# EAGLE schematic 1Sheeld.Schematics.v1.0.0 (EAGLE 6.3)
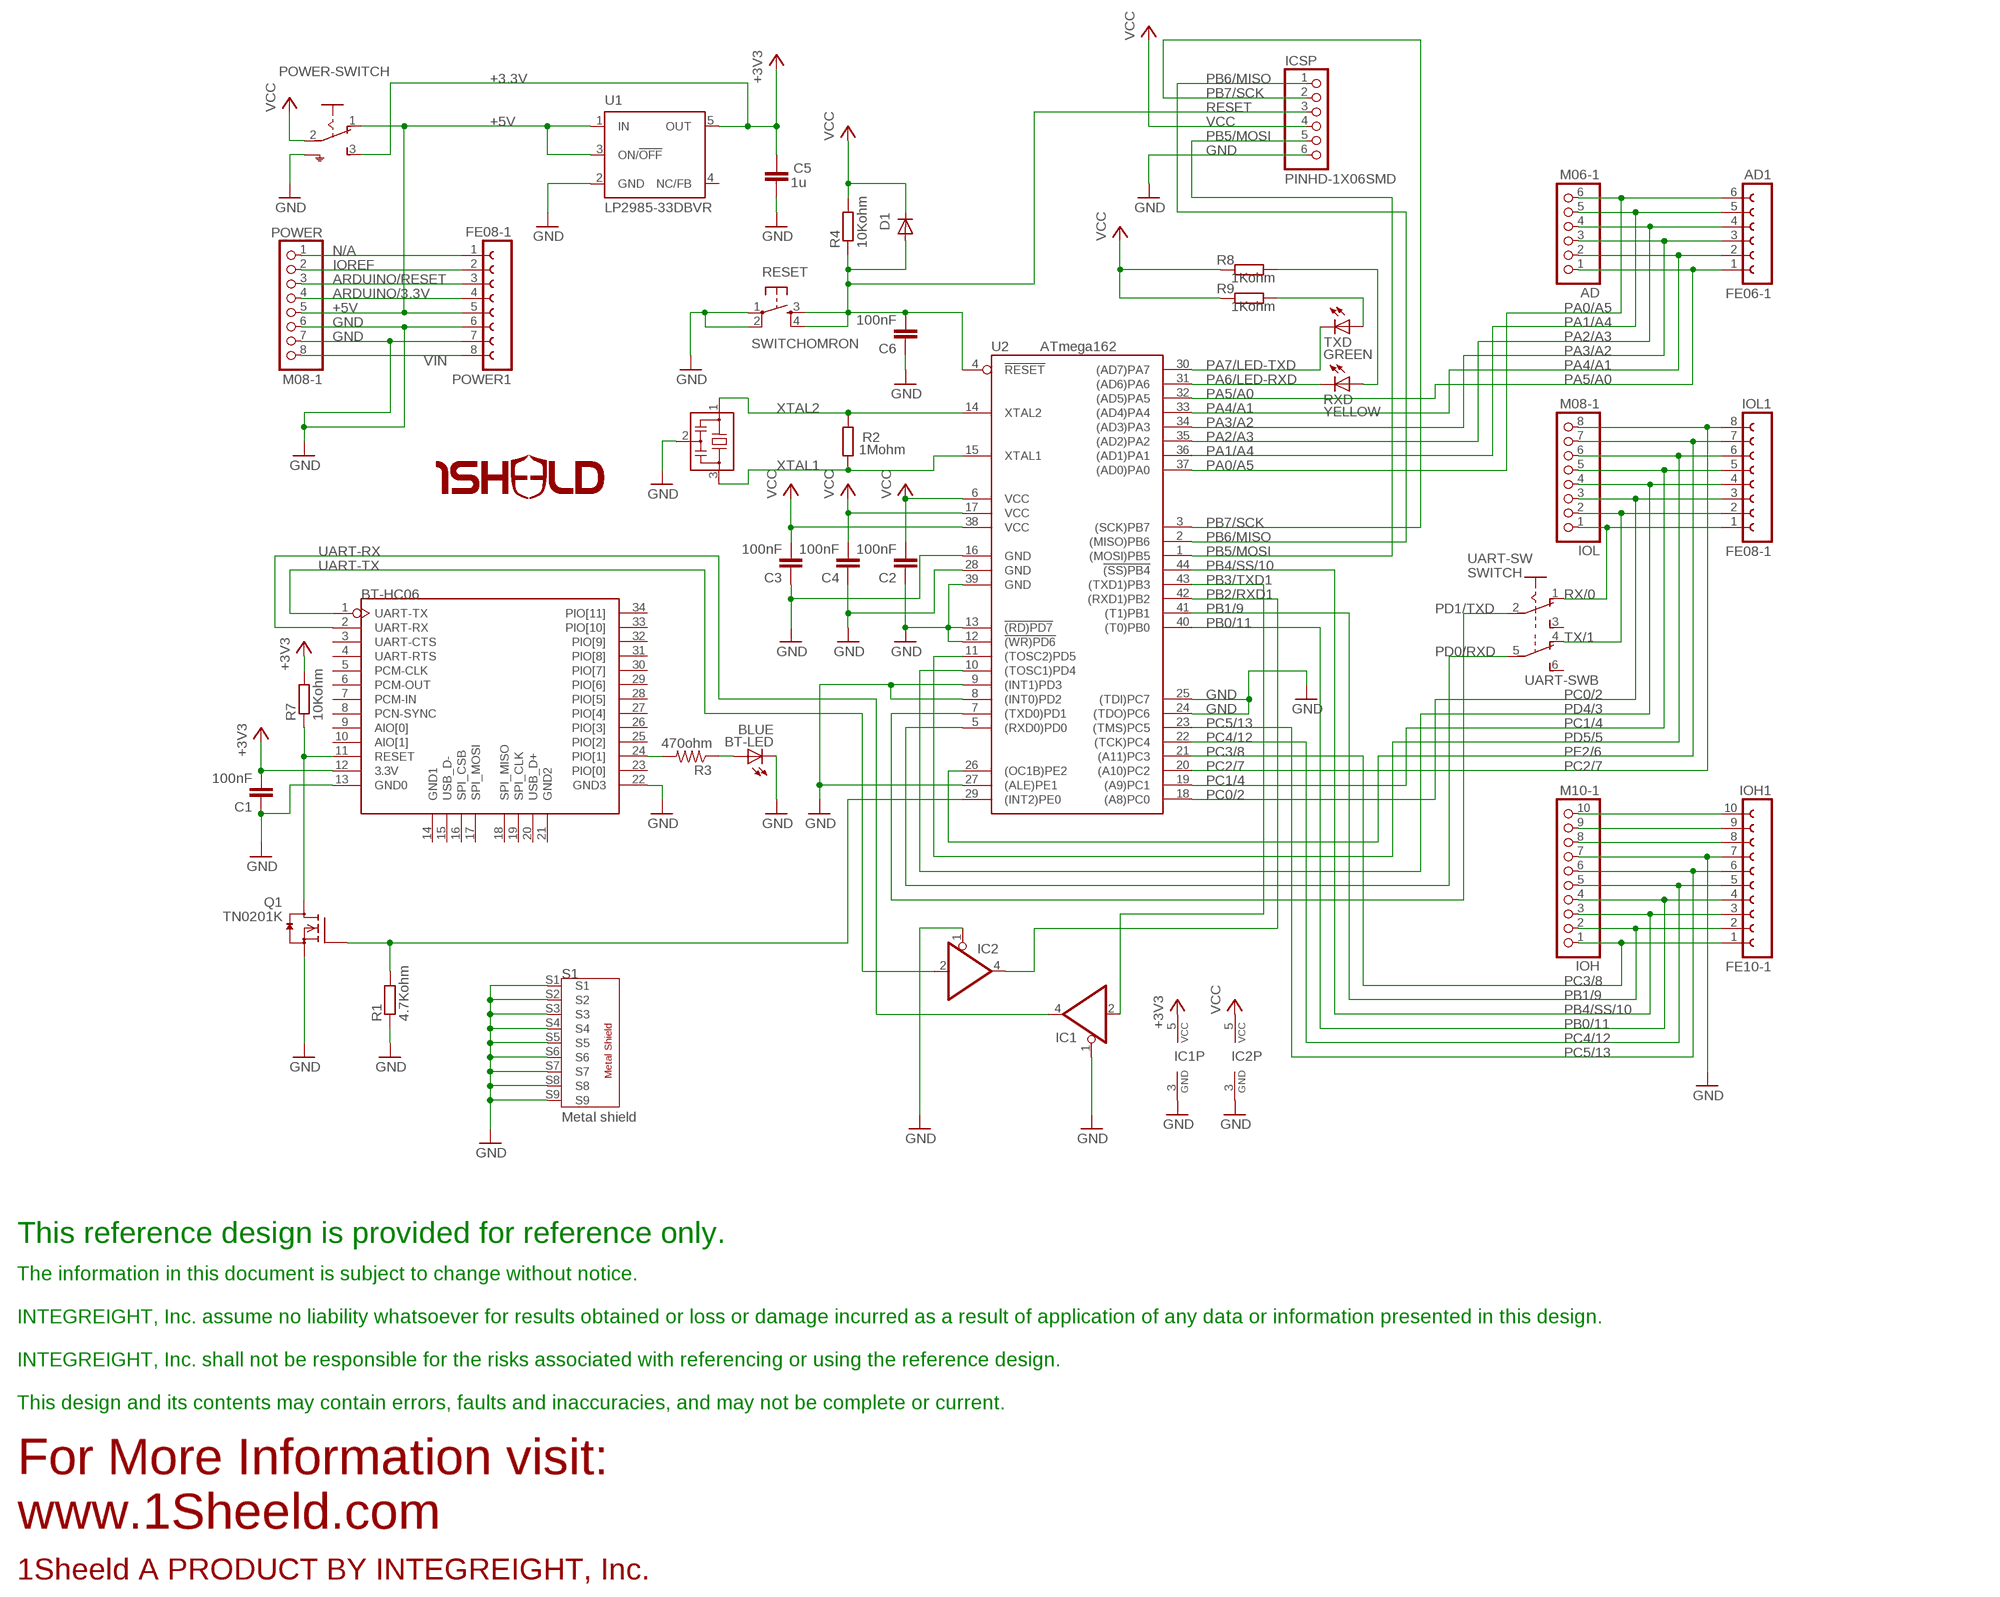
[diagram p0: schematic, sheet 1]

## Parts
AD  M06-1  PINHD-1X6  [1X06]
AD1  FE06-1  [FE06]
BT-HC06  BLUETOOTH-SERIALSMD  [SERIAL_BLUETEETH]
BT-LED  BLUE  LEDCHIP-LED0805  [CHIP-LED0805]
C1  100nF  C-EU0603-RND  [C0603-ROUND]
C2  100nF  C-EU0603-RND  [C0603-ROUND]
C3  100nF  C-EU0603-RND  [C0603-ROUND]
C4  100nF  C-EU0603-RND  [C0603-ROUND]
C5  1u  C-EU0603-RND  [C0603-ROUND]
C6  100nF  C-EU0603-RND  [C0603-ROUND]
D1  CD1206-S01575  DIODE-MINIMELF  [MINIMELF]
IC1  74LVC1G125DBV  [SOT23-5]
IC2  74LVC1G125DBV  [SOT23-5]
ICSP  PINHD-1X06SMD  [1X06/90SMD]
IOH  M10-1  PINHD-1X10_ARD  [1X10]
IOH1  FE10-1  [FE10]
IOL  M08-1  PINHD-1X8  [1X08]
IOL1  FE08-1  [FE08]
POWER  M08-1  PINHD-1X8  [1X08]
POWER1  FE08-1  [FE08]
POWER-SWITCH  MULTICOMP - MSS3-V-T/R  SWITCHMULTI  [SWITCHMULTI]
Q1  TN0201K  [SOT23]
R1  4.7Kohm  R-EU_M0805  [M0805]
R2  1Mohm  R-EU_R0603  [R0603-ROUND]
R3  470ohm  RESISTOR0402-RES  [0402-RES]
R4  10Kohm  R-EU_M0805  [M0805]
R7  10Kohm  R-EU_M0805  [M0805]
R8  1Kohm  R-EU_R0603  [R0603-ROUND]
R9  1Kohm  R-EU_R0603  [R0603-ROUND]
RESET  SWITCHOMRON  [OMRONSWITCH]
RXD  YELLOW  LEDCHIP-LED0805  [CHIP-LED0805]
S1  Metal shield  EMI_SHIELD_BT  [BT_SHIELD]
TXD  GREEN  LEDCHIP-LED0805  [CHIP-LED0805]
U1  LP2985-33DBVR  LP2985-XXDBVR33  [SOT23-DBV]
U2  ATmega162  ATMEGA162  [TQFP44]
UART-SW  SWITCH  [SWITCH]
Y1  CSTCR7M37G53-R0 7.37MHZ  CSTCR7M37G53-R0  [CSTCR6M]

## Nets
+3.3V: BT-HC06.12(3.3V) C1.2 C5.2 IC1.5(VCC) POWER-SWITCH.3(S) R7.2 U1.5(OUT) ; supply symbol labelled +3V3
+5V: POWER1.5 POWER-SWITCH.1(O) POWER.5 U1.1(IN) U1.3(ON/!OFF)
ARDUINO/3.3V: POWER1.4 POWER.4
ARDUINO/RESET: POWER1.3 POWER.3
BT-LED: BT-HC06.24(PIO[1]) R3.2
BT-RESET: BT-HC06.11(RESET) Q1.3(D) R7.1
GND: BT-HC06.13(GND0) BT-HC06.22(GND3) BT-LED.C C1.1 C2.1 C3.1 C4.1 C5.1 C6.1 IC1.1(OE) IC1.3(GND) IC2.1(OE) IC2.3(GND) ICSP.6 IOH1.7 IOH.7 POWER1.6 POWER1.7 POWER-SWITCH.P$4(SH) POWER-SWITCH.P$5(SH) POWER-SWITCH.P$6(SH) POWER-SWITCH.P$7(SH) POWER.6 POWER.7 Q1.2(S) R1.1 RESET.1(P) RESET.2(P1) S1.S1 S1.S2 S1.S3 S1.S4 S1.S5 S1.S6 S1.S7 S1.S8 S1.S9 U1.2(GND) U2.8((INT0)PD2) U2.9((INT1)PD3) U2.12(!(WR)PD6) U2.13(!(RD)PD7) U2.16(GND) U2.24((TDO)PC6) U2.25((TDI)PC7) U2.27((ALE)PE1) U2.28(GND) U2.39(GND) Y1.2
IOREF: POWER1.2 POWER.2
N$1: IOH1.10 IOH.10
N$2: IOH1.9 IOH.9
N$3: BT-LED.A R3.1
N$34: IOH1.8 IOH.8
N$42: R9.1 TXD.A
N$47: R8.1 RXD.A
N/A: POWER1.1 POWER.1
PA0/A5: AD1.6 AD.6 U2.37((AD0)PA0)
PA1/A4: AD1.5 AD.5 U2.36((AD1)PA1)
PA2/A3: AD1.4 AD.4 U2.35((AD2)PA2)
PA3/A2: AD1.3 AD.3 U2.34((AD3)PA3)
PA4/A1: AD1.2 AD.2 U2.33((AD4)PA4)
PA5/A0: AD1.1 AD.1 U2.32((AD5)PA5)
PA6/LED-RXD: RXD.C U2.31((AD6)PA6)
PA7/LED-TXD: TXD.C U2.30((AD7)PA7)
PB0/11: IOH1.4 IOH.4 U2.40((T0)PB0)
PB1/9: IOH1.2 IOH.2 U2.41((T1)PB1)
PB2/RXD1: IC2.4(O) U2.42((RXD1)PB2)
PB3/TXD1: IC1.2(I) U2.43((TXD1)PB3)
PB4/SS/10: IOH1.3 IOH.3 U2.44(!(SS)PB4)
PB5/MOSI: ICSP.5 U2.1((MOSI)PB5)
PB6/MISO: ICSP.1 U2.2((MISO)PB6)
PB7/SCK: ICSP.2 U2.3((SCK)PB7)
PC0/2: IOL1.3 IOL.3 U2.18((A8)PC0)
PC1/4: IOL1.5 IOL.5 U2.19((A9)PC1)
PC2/7: IOL1.8 IOL.8 U2.20((A10)PC2)
PC3/8: IOH1.1 IOH.1 U2.21((A11)PC3)
PC4/12: IOH1.5 IOH.5 U2.22((TCK)PC4)
PC5/13: IOH1.6 IOH.6 U2.23((TMS)PC5)
PD0/RXD: U2.5((RXD0)PD0) UART-SW.5(B:P)
PD1/TXD: U2.7((TXD0)PD1) UART-SW.2(A:P)
PD4/3: IOL1.4 IOL.4 U2.10((TOSC1)PD4)
PD5/5: IOL1.6 IOL.6 U2.11((TOSC2)PD5)
PE0: Q1.1(G) R1.2 U2.29((INT2)PE0)
PE2/6: IOL1.7 IOL.7 U2.26((OC1B)PE2)
RESET: C6.2 D1.A ICSP.3 R4.1 RESET.3(S) RESET.4(S1) U2.4(!RESET)
RX/0: IOL1.1 IOL.1 UART-SW.1(A:O)
TX/1: IOL1.2 IOL.2 UART-SW.4(B:O)
UART-RX: BT-HC06.2(UART-RX) IC1.4(O)
UART-TX: BT-HC06.1(UART-TX) IC2.2(I)
VCC: C2.2 C3.2 C4.2 D1.C IC2.5(VCC) ICSP.4 POWER-SWITCH.2(P) R4.2 R8.2 R9.2 U2.6(VCC) U2.17(VCC) U2.38(VCC)
VIN: POWER1.8 POWER.8
XTAL1: R2.1 U2.15(XTAL1) Y1.3
XTAL2: R2.2 U2.14(XTAL2) Y1.1
Unconnected: BT-HC06.3(UART-CTS) BT-HC06.4(UART-RTS) BT-HC06.5(PCM-CLK) BT-HC06.6(PCM-OUT) BT-HC06.7(PCM-IN) BT-HC06.8(PCN-SYNC) BT-HC06.9(AIO[0]) BT-HC06.10(AIO[1]) BT-HC06.14(GND1) BT-HC06.15(USB_D-) BT-HC06.16(SPI_CSB) BT-HC06.17(SPI_MOSI) BT-HC06.18(SPI_MISO) BT-HC06.19(SPI_CLK) BT-HC06.20(USB_D+) BT-HC06.21(GND2) BT-HC06.23(PIO[0]) BT-HC06.25(PIO[2]) BT-HC06.26(PIO[3]) BT-HC06.27(PIO[4]) BT-HC06.28(PIO[5]) BT-HC06.29(PIO[6]) BT-HC06.30(PIO[7]) BT-HC06.31(PIO[8]) BT-HC06.32(PIO[9]) BT-HC06.33(PIO[10]) BT-HC06.34(PIO[11]) U1.4(NC/FB) UART-SW.3(A:S) UART-SW.6(B:S)

## Notes on the sheet
- This reference design is provided for reference only.
- The information in this document is subject to change without notice.
  
  INTEGREIGHT, Inc. assume no liability whatsoever for results obtained or loss or damage incurred as a result of application of any data or information presented in this design.
  
  INTEGREIGHT, Inc. shall not be responsible for the risks associated with referencing or using the reference design.
  
  This design and its contents may contain errors, faults and inaccuracies, and may not be complete or current.
- For More Information visit:
  www.1Sheeld.com
- 1Sheeld A PRODUCT BY INTEGREIGHT, Inc.

## Library data of the parts
AD = SmartPrj:PINHD-1X6: PIN HEADER
AD1 = con-lsta:FE06-1: FEMALE HEADER; OC_FARNELL: unknown; OC_NEWARK: unknown
BT-HC06 = Module:BLUETOOTH-SERIAL: Bluetooth Module HC-06
BT-LED RXD TXD = led:LED: LED OSRAM: - CHIPLED LG R971, LG N971, LY N971, LG Q971, LY Q971, LO R971, LY R971 LH N974, LH R974 LS Q976, LO Q976, LY Q976 LO Q996 - Hyper CHIPLED LW Q18S LB Q993, LB Q99A, LB R99A - SideLED LS A670, LO A670, LY A670, LG A670, LP A670 LB A673, LV A673, LT A673, LW A673 LH A674 LY A675 LS A676, LA A676, LO A676, LY A676, LW A676 LS A679, LY A679, LG A679 - Hyper Micro SIDELED® LS Y876, LA Y876, LO Y876, LY Y876 LT Y87S - SmartLED LW L88C, LW L88S LB L89C, LB L89S, LG L890 LS L89K, LO L89K, LY L89K LS L896, LA L896, LO L896, LY L896 - TOPLED LS T670, LO T670, LY T670, LG T670, LP T670 LSG T670, LSP T670, LSY T670, LOP T670, LYG T670 LG T671, LOG T671, LSG T671 LB T673, LV T673, LT T673, LW T673 LH T674 LS T676, LA T676, LO T676, LY T676, LB T676, LH T676, LSB T676, LW T676 LB T67C, LV T67C, LT T67C, LS T67K, LO T67K, LY T67K, LW E67C LS E67B, LA E67B, LO E67B, LY E67B, LB E67C, LV E67C, LT E67C LW T67C LS T679, LY T679, LG T679 LS T770, LO T770, LY T770, LG T770, LP T770 LB T773, LV T773, LT T773, LW T773 LH T774 LS E675, LA E675, LY E675, LS T675 LS T776, LA T776, LO T776, LY T776, LB T776 LHGB T686 LT T68C, LB T68C - Hyper Mini TOPLED® LB M676 - Mini TOPLED Santana® LG M470 LS M47K, LO M47K, LY M47K Source: http://www.osram.convergy.de LUXEON: - LUMILED® LXK2-PW12-R00, LXK2-PW12-S00, LXK2-PW14-U00, LXK2-PW14-V00 LXK2-PM12-R00, LXK2-PM12-S00, LXK2-PM14-U00 LXK2-PE12-Q00, LXK2-PE12-R00, LXK2-PE12-S00, LXK2-PE14-T00, LXK2-PE14-U00 LXK2-PB12-K00, LXK2-PB12-L00, LXK2-PB12-M00, LXK2-PB14-N00, LXK2-PB14-P00, LXK2-PB14-Q00 LXK2-PR12-L00, LXK2-PR12-M00, LXK2-PR14-Q00, LXK2-PR14-R00 LXK2-PD12-Q00, LXK2-PD12-R00, LXK2-PD12-S00 LXK2-PH12-R00, LXK2-PH12-S00 LXK2-PL12-P00, LXK2-PL12-Q00, LXK2-PL12-R00 Source: www.luxeon.com KINGBRIGHT: KA-3528ASYC Source: www.kingbright.com
C1-C6 = SmartPrj:C-EU: CAPACITOR, European symbol
D1 = diode:DIODE-: DIODE
IC1 IC2 = 74xx-little-de:74*1G125: Single Bus Buffer Gate with 3-State Output
ICSP = pinhead:PINHD-1X06SMD
IOH = SmartPrj:PINHD-1X10_ARD: PIN HEADER
IOH1 = con-lsta:FE10-1: FEMALE HEADER; OC_FARNELL: unknown; OC_NEWARK: unknown
IOL POWER = SmartPrj:PINHD-1X8: PIN HEADER
IOL1 POWER1 = con-lsta:FE08-1: FEMALE HEADER; OC_FARNELL: unknown; OC_NEWARK: unknown
POWER-SWITCH = switch:SWITCHMULTI: MULTICOMP SWITCH, SPDT, 0.3A, 4VDC, SMD, HORIZ; MANUFACTURER-PART: MSS3-V-T/R
Q1 = m-pad-2.1:TN0201K: N-Channel 20−V (D−S) MOSFET
R1 R4 R7 = rcl:R-EU_: RESISTOR, European symbol
R2 R8 R9 = SmartPrj:R-EU_: RESISTOR, European symbol
R3 = SparkFun:RESISTOR: Resistor Basic schematic elements and footprints for 0603, 1206, and PTH 1/10th watt (small) resistors.
RESET = omronsmd:SWITCHOMRON: Middle-stroke Tactile Switch (SMT); MANUFACTURER-PART: B3SL-1022P
S1 = Module:EMI_SHIELD
U1 = SmartPrj:LP2985-XXDBVR: ULTRALOW-POWER 50-mA LOW-DROPOUT LINEAR REGULATORS 50-mA Low-Dropout Regulator Source: http://focus.ti.com/lit/ds/symlink/tps77001.pdf
U2 = ATmega162:ATMEGA162
UART-SW = 1sheeld:SWITCH
Y1 = murata-filter:CSTCR: Resonator CER RESONATOR Source: murata.co.jp

## Net classes
0 default: width 0.254 mm, clearance 0.254 mm
3 usbvcc: width 0.508 mm, drill 0.61 mm, clearance 0.254 mm